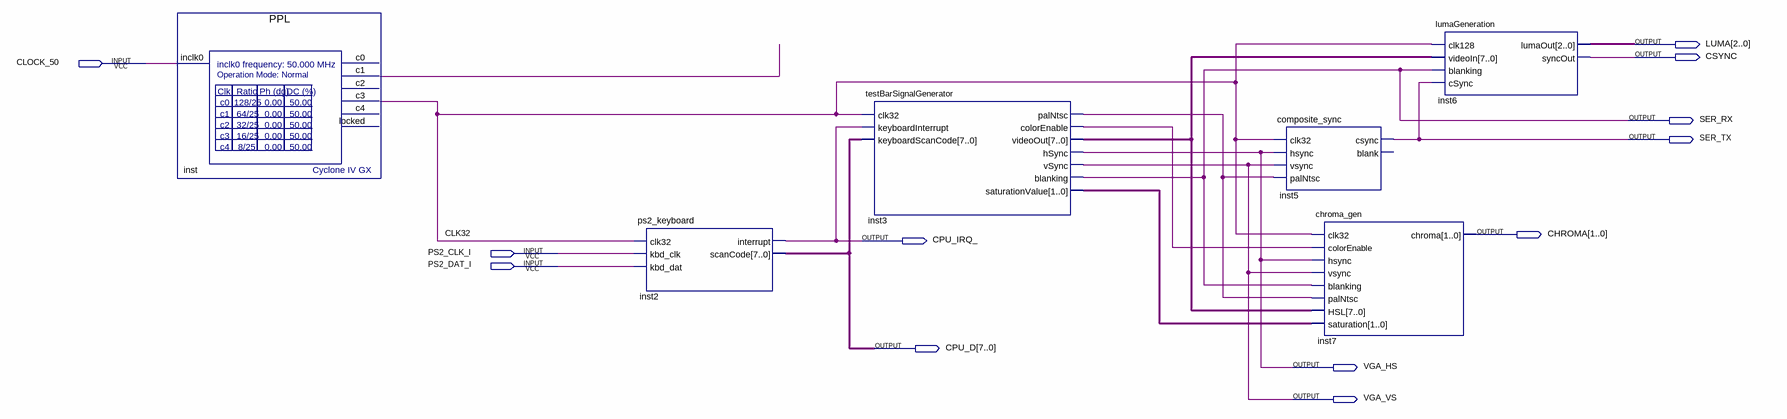
[diagram p0: schematic sheet]
// Quartus schematic TTT8BG.bdf as structural Verilog: 6 symbols, 12 pins
module TTT8BG (
  input  CLOCK_50,
  input  PS2_CLK_I,
  input  PS2_DAT_I,
  output [2:0] LUMA,
  output CSYNC,
  output SER_RX,
  output SER_TX,
  output [1:0] CHROMA,
  output CPU_IRQ_,
  output [7:0] CPU_D,
  output VGA_HS,
  output VGA_VS
);

  wire CLK32, inst3_colorenable, inst3_palntsc, inst_c1;
  wire [1:0] inst3_saturationvalue;
  wire [7:0] inst3_videoout;

  PPL inst (.inclk0(CLOCK_50), .c1(inst_c1), .c3(CLK32));  // open: c0, c2, c4, locked
  ps2_keyboard inst2 (.clk32(CLK32), .kbd_clk(PS2_CLK_I), .kbd_dat(PS2_DAT_I), .interrupt(CPU_IRQ_), .scanCode(CPU_D));
  testBarSignalGenerator inst3 (
    .clk32(CLK32), .keyboardInterrupt(CPU_IRQ_), .keyboardScanCode(CPU_D), .palNtsc(inst3_palntsc),
    .colorEnable(inst3_colorenable), .videoOut(inst3_videoout), .hSync(VGA_HS), .vSync(VGA_VS),
    .blanking(SER_RX), .saturationValue(inst3_saturationvalue));
  composite_sync inst5 (
    .clk32(CLK32), .hsync(VGA_HS), .vsync(VGA_VS), .palNtsc(inst3_palntsc), .csync(SER_TX));  // open: blank
  chroma_gen inst7 (
    .clk32(CLK32), .colorEnable(inst3_colorenable), .hsync(VGA_HS), .vsync(VGA_VS), .blanking(SER_RX),
    .palNtsc(inst3_palntsc), .HSL(inst3_videoout), .saturation(inst3_saturationvalue), .chroma(CHROMA));
  lumaGeneration inst6 (
    .clk128(CLK32), .videoIn(inst3_videoout), .blanking(SER_RX), .cSync(SER_TX), .lumaOut(LUMA),
    .syncOut(CSYNC));
endmodule
